# EAGLE design 2564Adapter (EAGLE 7.7.0)
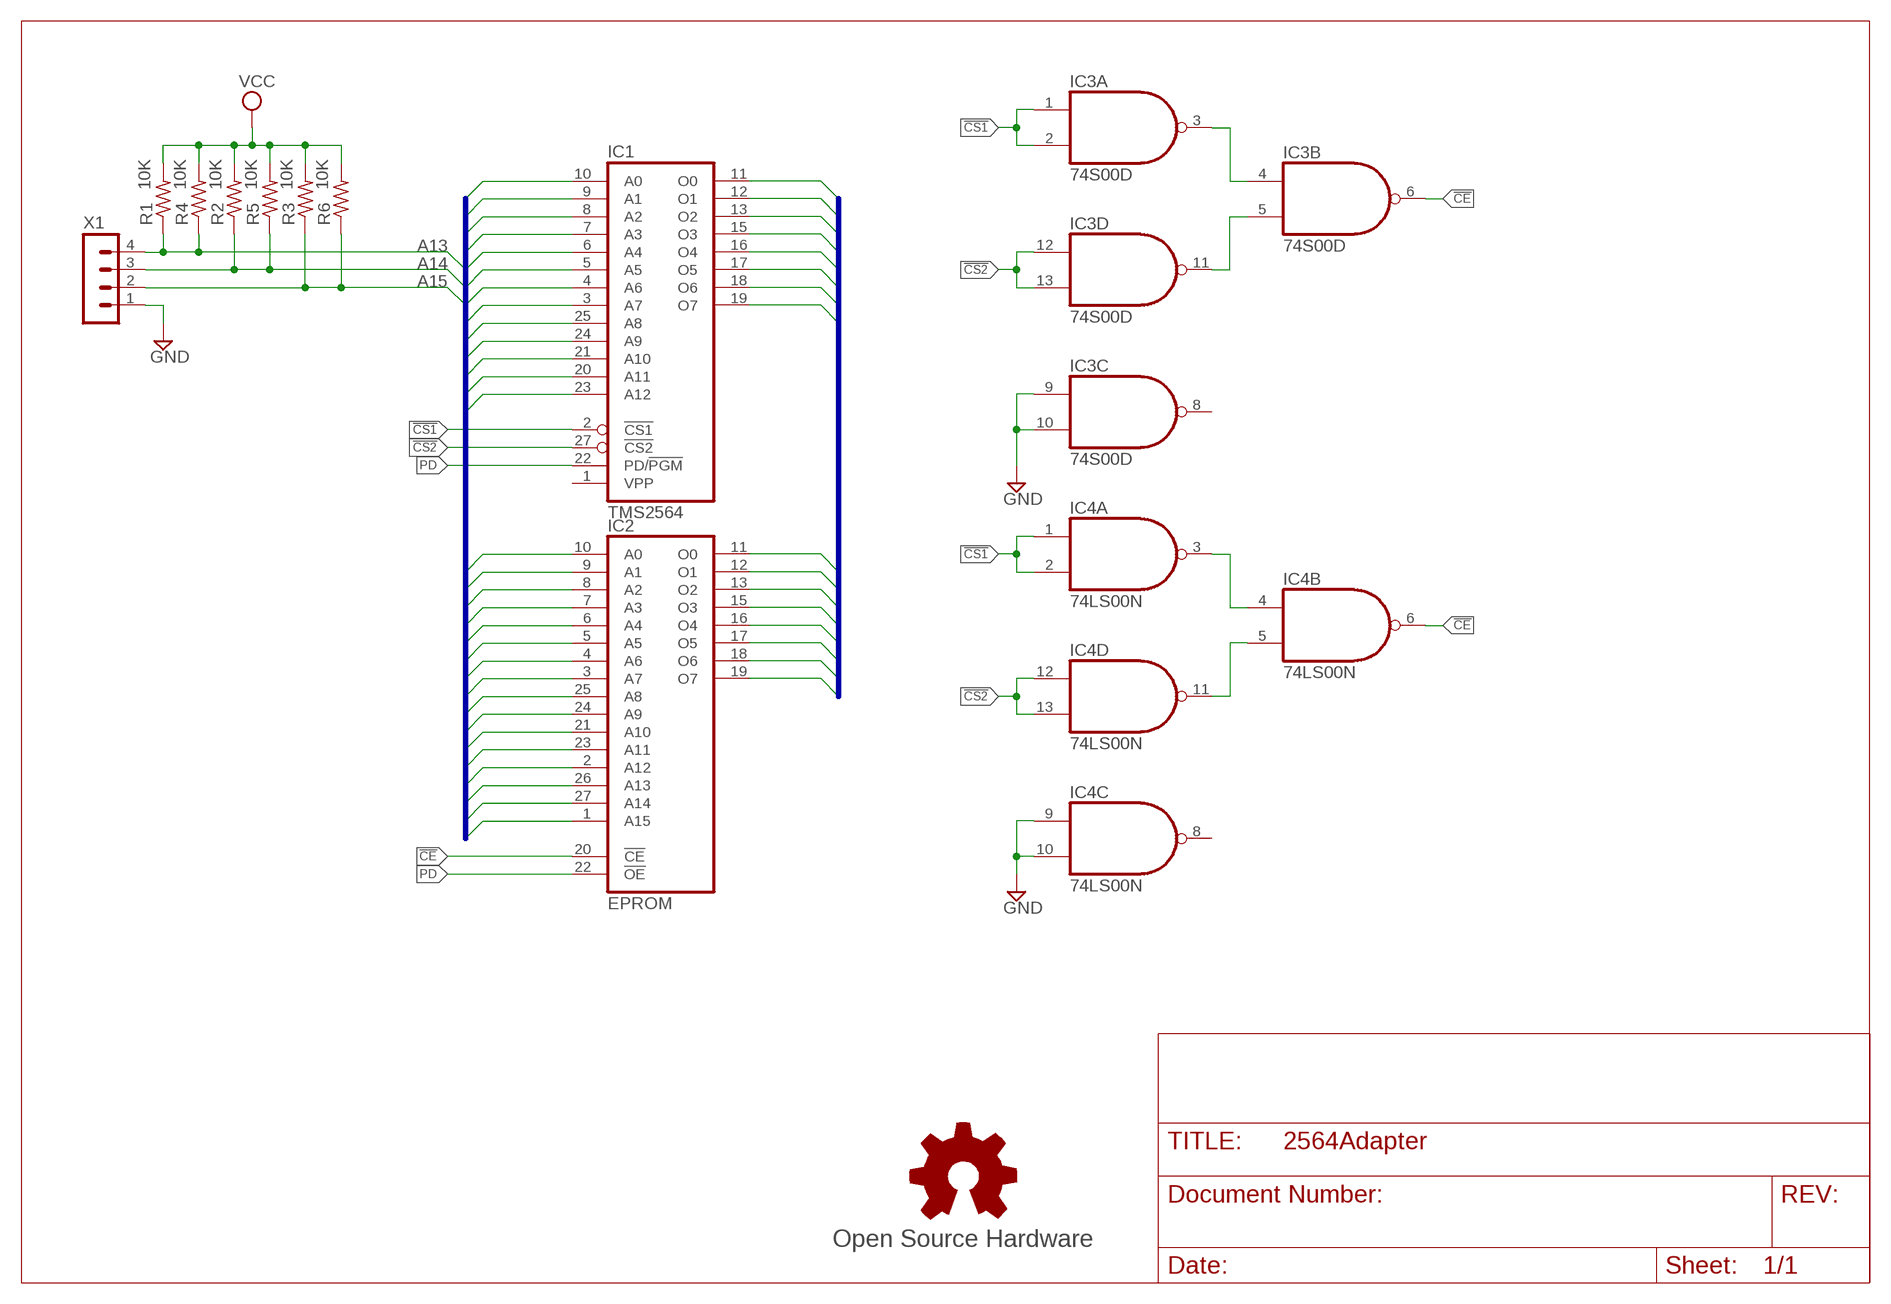
[diagram p0: schematic, sheet 1]

## Parts
GOLD_ORB_SM1  Open Source Hardware  OSHWLOGOLOGO5MM  [OSHW_5MM]
IC1  TMS2564  TMS2564-RP  [DIL28-ROUNDPAD]
IC2  EPROM  27512'RD'  [DIL28-ROUNDPAD]
IC3  74S00D  [SO14]
IC4  74LS00N  [DIL14-RP]
R1  10K  R-US_0204/5  [0204/5]
R2  10K  R-US_0204/5  [0204/5]
R3  10K  R-US_0204/5  [0204/5]
R4  10K  R-US_R0805  [R0805]
R5  10K  R-US_R0805  [R0805]
R6  10K  R-US_R0805  [R0805]
X1  MA04-1  [MA04-1]

## Nets
!CE: IC2.20(!CE) IC3.6(B:O) IC4.6(B:O)
!CS1: IC1.2(!CS1) IC3.1(A:I0) IC3.2(A:I1) IC4.1(A:I0) IC4.2(A:I1)
!CS2: IC1.27(!CS2) IC3.12(D:I0) IC3.13(D:I1) IC4.12(D:I0) IC4.13(D:I1)
A0: IC1.10(A0) IC2.10(A0)
A1: IC1.9(A1) IC2.9(A1)
A2: IC1.8(A2) IC2.8(A2)
A3: IC1.7(A3) IC2.7(A3)
A4: IC1.6(A4) IC2.6(A4)
A5: IC1.5(A5) IC2.5(A5)
A6: IC1.4(A6) IC2.4(A6)
A7: IC1.3(A7) IC2.3(A7)
A8: IC1.25(A8) IC2.25(A8)
A9: IC1.24(A9) IC2.24(A9)
A10: IC1.21(A10) IC2.21(A10)
A11: IC1.20(A11) IC2.23(A11)
A12: IC1.23(A12) IC2.2(A12)
A13: IC2.26(A13) R1.1 R4.1 X1.4
A14: IC2.27(A14) R2.1 R5.1 X1.3
A15: IC2.1(A15) R3.1 R6.1 X1.2
D0: IC1.11(O0) IC2.11(O0)
D1: IC1.12(O1) IC2.12(O1)
D2: IC1.13(O2) IC2.13(O2)
D3: IC1.15(O3) IC2.15(O3)
D4: IC1.16(O4) IC2.16(O4)
D5: IC1.17(O5) IC2.17(O5)
D6: IC1.18(O6) IC2.18(O6)
D7: IC1.19(O7) IC2.19(O7)
GND: IC3.9(C:I0) IC3.10(C:I1) IC4.9(C:I0) IC4.10(C:I1) X1.1
N$1: IC4.3(A:O) IC4.4(B:I0)
N$2: IC4.5(B:I1) IC4.11(D:O)
N$3: IC3.3(A:O) IC3.4(B:I0)
N$4: IC3.5(B:I1) IC3.11(D:O)
PD: IC1.22(PD/!PGM) IC2.22(!OE)
VCC: R1.2 R2.2 R3.2 R4.2 R5.2 R6.2
Unconnected: IC1.1(VPP) IC3.8(C:O) IC4.8(C:O)

## Buses
A[0..15]
D[0..7]

## Power pins joined to a net without a drawn wire
GND: IC1.14(GND) IC2.14(GND) IC3.7(P:GND) IC4.7(P:GND)
VCC: IC1.26(VCC) IC1.28(VCC) IC2.28(VCC) IC3.14(P:VCC) IC4.14(P:VCC)

## Library data of the parts
GOLD_ORB_SM1 = oshw:OSHWLOGO: The OSHW logo for PCB layout
IC1 = memory-ti:TMS2564: MEMORY
IC2 = 0RB_Memory:27512
IC3 = 74xx-us:74*00: Quad 2-input NAND gate
IC4 = 74xx-us-jlb:74*00: Quad 2-input NAND gate
R1-R6 = resistor:R-US_: RESISTOR, American symbol
X1 = con-lstb-rp:MA04-1: PIN HEADER; OC_FARNELL: unknown; OC_NEWARK: unknown

## Board
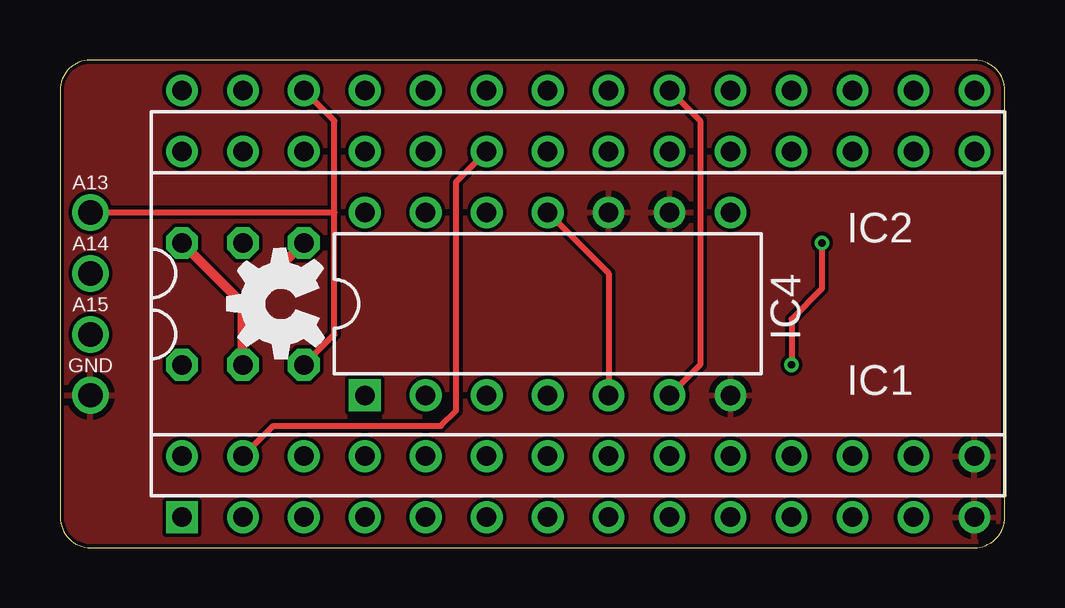
[diagram p1: board, top side]
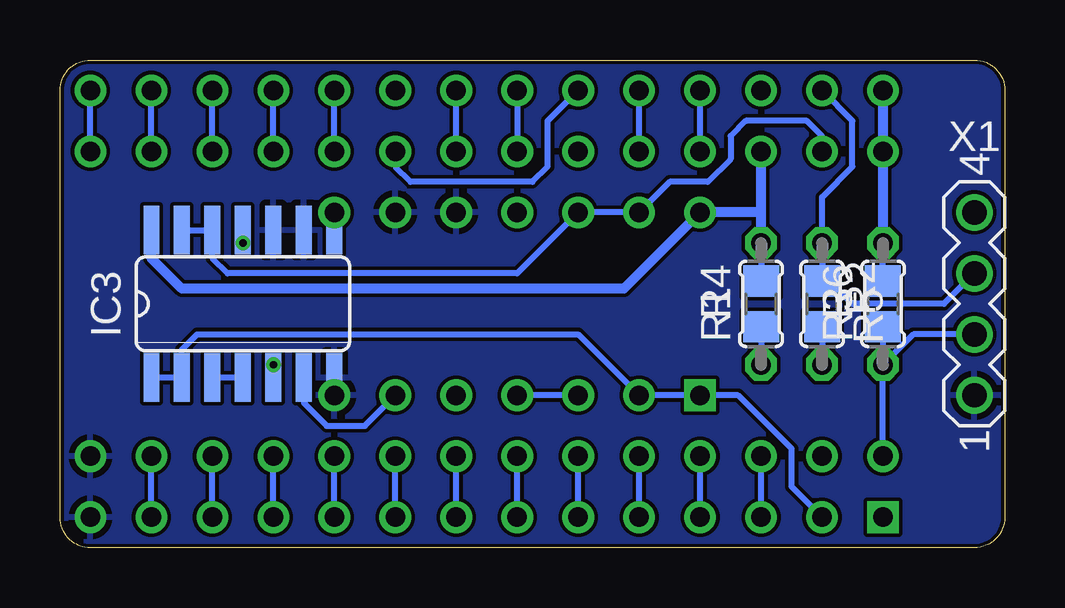
[diagram p2: board, bottom side, seen from below]

Size 39.37 x 20.32 mm. Coordinates in mm from the lower left corner, seen from the top.
Outline: 0,19.05 0.01,1.27 arc90 1.28,0 38.1,0 arc90 39.37,1.27 39.37,19.05 arc90 38.1,20.32 1.27,20.32 arc90 0,19.05
Copper layers (1*16): Top 0.035mm / dielectric 1.5mm / Bottom 0.035mm
Design rules "hackvana *": minimum track width 6mil, minimum drill 0.3mm, track to track 6mil, track to pad 6mil, pad to pad 6mil, via to via 6mil, smd to smd 0mil, copper to edge 6mil, drill to drill 6mil, minimum pad ring 10mil, minimum via ring 6mil, stop-mask expansion 2mil, vias tented up to drill 100mil, thermal gap 10mil

### Footprints (pad centres in the part's own frame; a part is rotated, then mirrored left to right if it is on the bottom)
DIL28-ROUNDPAD = drill 0.813 square: 1 -16.51,-7.62 | drill 0.813: 2 -13.97,-7.62; 3 -11.43,-7.62; 4 -8.89,-7.62; 5 -6.35,-7.62; 6 -3.81,-7.62; 7 -1.27,-7.62; 8 1.27,-7.62; 9 3.81,-7.62; 10 6.35,-7.62; 11 8.89,-7.62; 12 11.43,-7.62; 13 13.97,-7.62; 14 16.51,-7.62; 15 16.51,7.62; 16 13.97,7.62; 17 11.43,7.62; 18 8.89,7.62; 19 6.35,7.62; 20 3.81,7.62; 21 1.27,7.62; 22 -1.27,7.62; 23 -3.81,7.62; 24 -6.35,7.62; 25 -8.89,7.62; 26 -11.43,7.62; 27 -13.97,7.62; 28 -16.51,7.62
DIL28-ROUNDPAD' = drill 0.813: 1 -16.51,-7.62; 2 -13.97,-7.62; 3 -11.43,-7.62; 4 -8.89,-7.62; 5 -6.35,-7.62; 6 -3.81,-7.62; 7 -1.27,-7.62; 8 1.27,-7.62; 9 3.81,-7.62; 10 6.35,-7.62; 11 8.89,-7.62; 12 11.43,-7.62; 13 13.97,-7.62; 14 16.51,-7.62; 15 16.51,7.62; 16 13.97,7.62; 17 11.43,7.62; 18 8.89,7.62; 19 6.35,7.62; 20 3.81,7.62; 21 1.27,7.62; 22 -1.27,7.62; 23 -3.81,7.62; 24 -6.35,7.62; 25 -8.89,7.62; 26 -11.43,7.62; 27 -13.97,7.62; 28 -16.51,7.62
SO14 = smd 0.66 x 2.032: 1 -3.81,-3.073; 2 -2.54,-3.073; 3 -1.27,-3.073; 4 0,-3.073; 5 1.27,-3.073; 6 2.54,-3.073; 7 3.81,-3.073; 8 3.81,3.073; 9 2.54,3.073; 10 1.27,3.073; 11 0,3.073; 12 -1.27,3.073; 13 -2.54,3.073; 14 -3.81,3.073
DIL14-RP = drill 0.813 square: 1 -7.62,-3.81 | drill 0.813: 2 -5.08,-3.81; 3 -2.54,-3.81; 4 0,-3.81; 5 2.54,-3.81; 6 5.08,-3.81; 7 7.62,-3.81; 8 7.62,3.81; 9 5.08,3.81; 10 2.54,3.81; 11 0,3.81; 12 -2.54,3.81; 13 -5.08,3.81; 14 -7.62,3.81
0204/5 = drill 0.813 octagon: 1 -2.54,0; 2 2.54,0
R0805 = smd 1.3 x 1.5: 1 -0.95,0; 2 0.95,0
MA04-1 = drill 1.016: 1 -3.81,0; 2 -1.27,0; 3 1.27,0; 4 3.81,0

### Placement (x,y rotation side)
GOLD_ORB_SM1  9.21,10.16 90 top
IC1  21.59,8.89 0 top
IC2  EPROM  [DIL28-ROUNDPAD']  21.59,11.43 0 top
IC3  31.75,10.16 0 bottom
IC4  20.32,10.16 0 top
R1  10.16,10.16 90 bottom
R2  7.62,10.16 270 bottom
R3  5.08,10.16 90 bottom
R4  10.16,10.16 90 bottom
R5  7.62,10.16 270 bottom
R6  5.08,10.16 90 bottom
X1  1.27,10.16 90 bottom

### Tracks (layer width: path | path; a pad name or v marks a point on that pad's centre or on a via)
!CE
  Top 0.254: IC2.20 26.67,17.78 26.67,7.62 IC4.6
  Bottom 0.254: IC3.6 29.21,6.03 28.26,5.08 26.67,5.08 IC4.6
!CS1
  Bottom 0.254: IC1.2 8.89,2.54 8.89,4.13 11.11,6.35 IC4.1 IC4.2 17.78,8.89 33.65,8.89 34.29,8.26 IC3.2 IC3.1
!CS2
  Bottom 0.254: IC1.27 7.62,17.14 8.25,17.78 10.79,17.78 11.43,17.14 11.43,16.19 12.38,15.24 13.97,15.24 IC4.13 IC4.12 20.32,11.43 32.38,11.43 33.02,12.06 IC3.12 IC3.13
A0
  Bottom 0.254: IC1.10 IC2.10
A1
  Bottom 0.254: IC1.9 IC2.9
A2
  Bottom 0.254: IC1.8 IC2.8
A3
  Bottom 0.254: IC1.7 IC2.7
A4
  Bottom 0.254: IC1.6 IC2.6
A5
  Bottom 0.254: IC1.5 IC2.5
A6
  Bottom 0.254: IC1.4 IC2.4
A7
  Bottom 0.254: IC1.3 IC2.3
A8
  Bottom 0.254: IC1.25 IC2.25
A9
  Bottom 0.254: IC1.24 IC2.24
A10
  Bottom 0.254: IC1.21 IC2.21
A11
  Bottom 0.254: IC1.20 25.4,15.88 24.76,15.24 19.68,15.24 19.05,15.88 19.05,17.78 IC2.23
A12
  Top 0.254: IC1.23 16.51,15.24 16.51,5.71 15.87,5.08 8.89,5.08 IC2.2
A13
  Top 0.254: R1.1 11.43,8.89 11.43,13.97 | 11.43,13.97 11.43,17.78 IC2.26 | X1.4 11.43,13.97
  Bottom 0.254: R4.1 R1.1
A14
  Bottom 0.254: IC2.27 6.35,17.78 6.35,15.88 7.62,14.61 R2.1 R5.1 7.3,11.11 6.35,10.16 2.54,10.16 X1.3
A15
  Bottom 0.254: IC2.1 R3.1 | X1.2 3.81,8.89 R3.1 | R6.1 R3.1
D0
  Bottom 0.254: IC1.11 IC2.11
D1
  Bottom 0.254: IC1.12 IC2.12
D2
  Bottom 0.254: IC1.13 IC2.13
D3
  Bottom 0.254: IC1.15 IC2.15
D4
  Bottom 0.254: IC1.16 IC2.16
D5
  Bottom 0.254: IC1.17 IC2.17
D6
  Bottom 0.254: IC1.18 IC2.18
D7
  Bottom 0.254: IC1.19 IC2.19
GND
  pour Top: 38.1,0 1.27,0 arc-90 0,1.27 0,19.05 arc-90 1.27,20.32 38.1,20.32 arc-90 39.37,19.05 39.37,1.27 arc-90
  pour Bottom: 38.1,0 1.27,0 arc-90 0,1.27 0,19.05 arc-90 1.27,20.32 38.1,20.32 arc-90 39.37,19.05 39.37,1.27 arc-90
N$1
  Bottom 0.254: IC4.3 IC4.4
N$2
  Top 0.254: IC4.11 22.86,11.43 IC4.5
N$3
  Bottom 0.254: IC3.4 IC3.3
N$4  (via drill 0.3)
  Top 0.254: v31.75,12.7 31.75,10.79 30.48,9.53 v30.48,7.62
  Bottom 0.254: IC3.11 v31.75,12.7 | v30.48,7.62 IC3.5
PD
  Bottom 0.254: IC2.22 IC1.22
VCC
  Top 0.406: R2.2 7.62,10.16 | 7.62,10.16 R3.2 | 7.62,10.16 R1.2
  Bottom 0.254: R6.2 R3.2 | R1.2 R4.2 | R5.2 R2.2
  Bottom 0.406: IC2.28 IC1.28 R3.2 | 10.16,13.97 IC1.26 | 10.16,13.97 IC4.14 15.87,10.79 34.29,10.79 35.56,12.06 IC3.14 | R1.2 10.16,13.97

### Text on the board
tNames: A13 | A14 | A15 | GND
tValues: (c) 2018-19 RETRO Innovations | www.go4retro.com